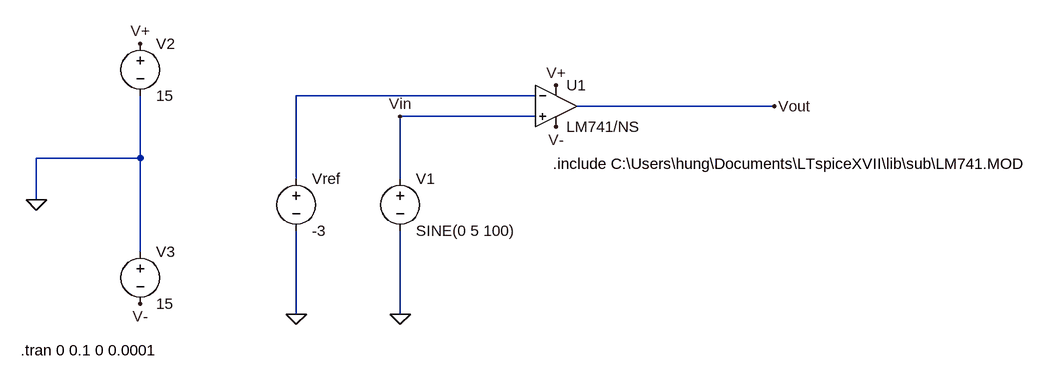
[diagram p0: schematic lab 7 part 1.asc]
lab 7 part 1.asc, the LTspice schematic file:
Version 4
SHEET 1 1036 680
WIRE 224 48 -144 48
WIRE 592 64 288 64
WIRE 224 80 16 80
WIRE -384 144 -384 48
WIRE -384 144 -544 144
WIRE -144 176 -144 48
WIRE 16 176 16 80
WIRE -544 208 -544 144
WIRE -384 288 -384 144
WIRE -144 384 -144 256
WIRE 16 384 16 256
FLAG 256 32 V+
FLAG 256 96 V-
FLAG 592 64 Vout
FLAG -544 208 0
FLAG -144 384 0
FLAG 16 384 0
FLAG -384 -32 V+
FLAG -384 368 V-
FLAG 16 80 Vin
SYMBOL Opamps\\opamp2 256 0 R0
SYMATTR InstName U1
SYMATTR Value LM741/NS
SYMBOL voltage 16 160 R0
WINDOW 123 0 0 Left 0
WINDOW 39 0 0 Left 0
SYMATTR InstName V1
SYMATTR Value SINE(0 5 100)
SYMBOL voltage -384 -48 R0
WINDOW 123 0 0 Left 0
WINDOW 39 0 0 Left 0
SYMATTR InstName V2
SYMATTR Value 15
SYMBOL voltage -384 272 R0
WINDOW 123 0 0 Left 0
WINDOW 39 0 0 Left 0
SYMATTR InstName V3
SYMATTR Value 15
SYMBOL voltage -144 160 R0
WINDOW 123 0 0 Left 0
WINDOW 39 0 0 Left 0
SYMATTR InstName Vref
SYMATTR Value -3
TEXT 616 168 Bottom 2 !.include C:\\Users\\hung\\Documents\\LTspiceXVII\\lib\\sub\\LM741.MOD
TEXT -568 440 Left 2 !.tran 0 0.1 0 0.0001

The netlist it stands for:
* lab 7 part 1.asc
XU1 Vin N001 V+ V- Vout LM741/NS  ; pins In+ In- V+ V- OUT
V1 Vin 0 SINE(0 5 100)
V2 V+ 0 15
V3 0 V- 15
Vref N001 0 -3
.include C:\Users\hung\Documents\LTspiceXVII\lib\sub\LM741.MOD
.tran 0 0.1 0 0.0001
.backanno
.end